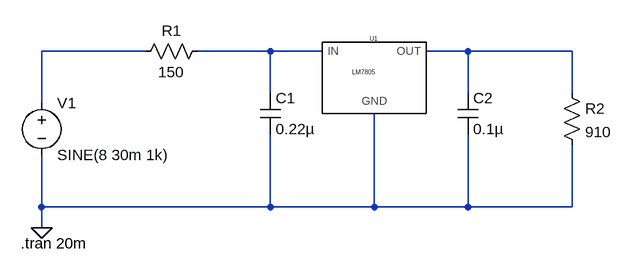
[diagram p0: schematic lab6.asc]
lab6.asc, the LTspice schematic file:
Version 4
SHEET 1 880 680
WIRE -144 96 -304 96
WIRE 48 96 -64 96
WIRE 128 96 48 96
WIRE 352 96 288 96
WIRE 512 96 352 96
WIRE 48 160 48 96
WIRE 352 160 352 96
WIRE 512 160 512 96
WIRE -304 176 -304 96
WIRE -304 336 -304 256
WIRE 48 336 48 224
WIRE 48 336 -304 336
WIRE 208 336 208 192
WIRE 208 336 48 336
WIRE 352 336 352 224
WIRE 352 336 208 336
WIRE 512 336 512 240
WIRE 512 336 352 336
WIRE -304 368 -304 336
FLAG -304 368 0
SYMBOL LM7805 208 128 R0
SYMATTR InstName U1
SYMBOL cap 32 160 R0
SYMATTR InstName C1
SYMATTR Value 0.22µ
SYMBOL cap 336 160 R0
SYMATTR InstName C2
SYMATTR Value 0.1µ
SYMBOL res -48 80 R90
WINDOW 0 0 56 VBottom 2
WINDOW 3 32 56 VTop 2
SYMATTR InstName R1
SYMATTR Value 150
SYMBOL voltage -304 160 R0
WINDOW 123 0 0 Left 0
WINDOW 39 0 0 Left 0
SYMATTR InstName V1
SYMATTR Value SINE(8 30m 1k)
SYMBOL res 496 144 R0
SYMATTR InstName R2
SYMATTR Value 910
TEXT -336 392 Left 2 !.tran 20m

The netlist it stands for:
* lab6.asc
XU1 N002 0 N003 LM7805  ; pins IN GND OUT
C1 N002 0 0.22µ
C2 N003 0 0.1µ
R1 N002 N001 150
V1 N001 0 SINE(8 30m 1k)
R2 N003 0 910
.tran 20m
.lib LM7805.sub
.backanno
.end